# Altium schematic sheet PROC091F_RST_GPIOs_I2C.SchDoc: BREAKAWAY_SECTION2
size 431 x 279 mm; Date: Not shown in title block; ApprovedBy: Not shown in title block; CheckedBy: Not shown in title block; Author: Not shown in title block; CompanyName: Not shown in title block; DrawnBy: Antony/Bala; Engineer: Not shown in title block; Organization: Not shown in title block; Address1: Not shown in title block; Address2: Not shown in title block; Address3: Not shown in title block; Address4: Not shown in title block; DocumentNumber: 8; Revision: Use project parameter SCH_Rev; SheetNumber: 8; SheetTotal: 12; PageSetup: Record=PageOptions|CenterHorizontal=True|CenterVertical=True|PrintScale=1.00|XCorrection=1.00|YCorrection=1.00|PrintKind=0|BorderSize=5000000|LeftOffset=0|BottomOffset=0|Orientation=2|PaperLength=1000|PaperWidth=1000|Scale=100|PaperSource=15|PrintQuality=600|MediaType=1|DitherType=10|PaperKind=Letter|PrintScaleMode=1; CurrentTime: Not shown in title block; CurrentDate: Not shown in title block; Time: Not shown in title block; DocumentFullPathAndName: Not shown in title block; DocumentName: Not shown in title block; ModifiedDate: Not shown in title block; ImagePath: Not shown in title block
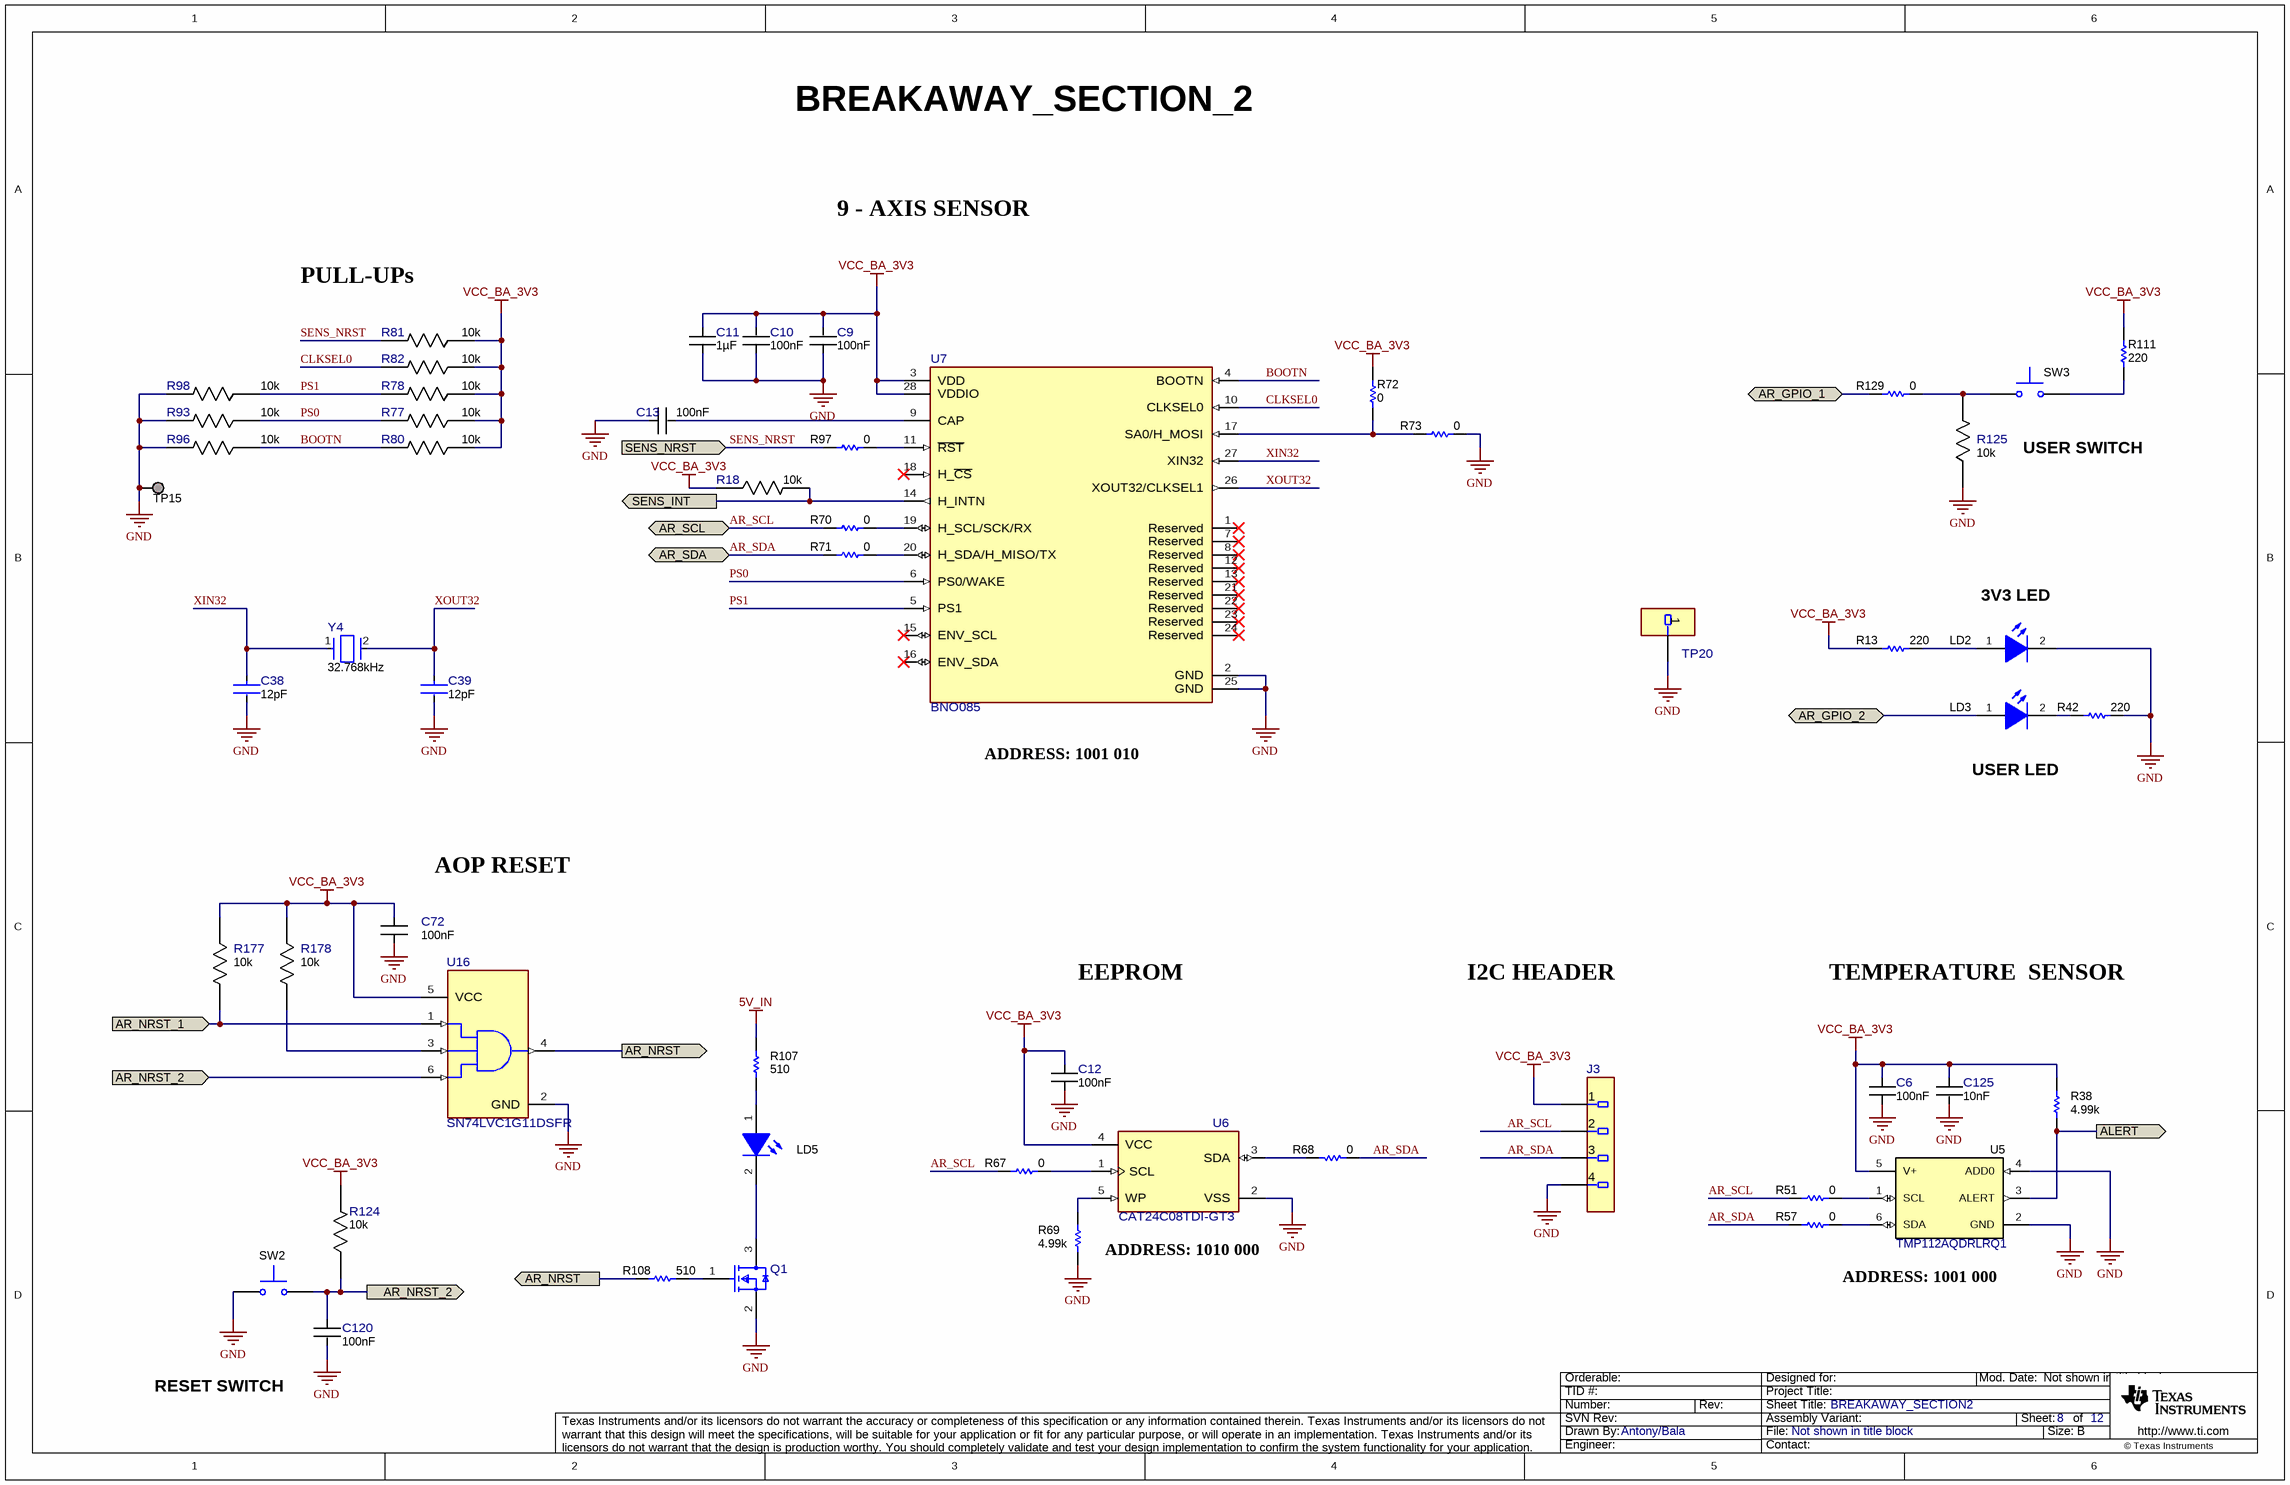
[diagram p0: PROC091F_RST_GPIOs_I2C.SchDoc]

## Parts
C6  Cap_F: 100nF  [FP-GRM033R6YA104KE14D_0201 (0603 Metric)-IPC_C]  (hidden comment: GRM033R6YA104KE14D)
C9  Cap_F: 100nF  [FP-GRM033R6YA104KE14D_0201 (0603 Metric)-IPC_C]  (hidden comment: GRM033R6YA104KE14D)
C10  Cap_F: 100nF  [FP-GRM033R6YA104KE14D_0201 (0603 Metric)-IPC_C]  (hidden comment: GRM033R6YA104KE14D)
C11  Cap_F: 1µF  [FP-CL03A105MO3NRNH_0201-IPC_C]  (hidden comment: CL03A105MO3NRNH)
C12  Cap_F: 100nF  [FP-GRM033R6YA104KE14D_0201 (0603 Metric)-IPC_C]  (hidden comment: GRM033R6YA104KE14D)
C13  Cap_F: 100nF  [FP-GRM033R6YA104KE14D_0201 (0603 Metric)-IPC_C]  (hidden comment: GRM033R6YA104KE14D)
C38  Cap_F: 12pF  [FP-250R05L120JV4T_0201-IPC_C]  (hidden comment: 250R05L120JV4T)
C39  Cap_F: 12pF  [FP-250R05L120JV4T_0201-IPC_C]  (hidden comment: 250R05L120JV4T)
C72  Cap_F: 100nF  [FP-GRM033R6YA104KE14D_0201 (0603 Metric)-IPC_C]  (hidden comment: GRM033R6YA104KE14D)
C120  Cap_F: 100nF  [FP-GRM033R6YA104KE14D_0201 (0603 Metric)-IPC_C]  (hidden comment: GRM033R6YA104KE14D)
C125  Cap_F: 10nF  [FP-CL03A103KA3NNNC_0201-IPC_C]  (hidden comment: CL03A103KA3NNNC)
J3  M50-3930442  [FP-M50-3930442_HDR4-Recommended_Land_Pattern]  (value not drawn)
LD2  APHHS1005CGCK  [APHHS1005_Green]  (value not drawn)
LD3  APHHS1005CGCK  [APHHS1005_Green]  (value not drawn)
LD5  APHHS1005CGCK  [APHHS1005_Green]  (value not drawn)
Q1  BSS123-7-F  [FP-BSS123-7-F_SOT23-IPC_C]  (value not drawn)
R13  value 220  [0201L]  (hidden comment: RC0201JR-07220RL)
R18  Res_ohm: 10k  [FP-RR0306P-103-D_0201-IPC_C]  (hidden comment: RR0306P-103-D)
R38  value 4.99k  [0201L]  (hidden comment: RC0201FR-074K99L)
R42  value 220  [0201L]  (hidden comment: RC0201JR-07220RL)
R51  Res_ohm: 0  [FP-RC0201JR-070RL_0201 (0603 Metric)-MFG]  (hidden comment: RC0201JR-070RL)
R57  Res_ohm: 0  [FP-RC0201JR-070RL_0201 (0603 Metric)-MFG]  (hidden comment: RC0201JR-070RL)
R67  Res_ohm: 0  [FP-RC0201JR-070RL_0201 (0603 Metric)-MFG]  (hidden comment: RC0201JR-070RL)
R68  Res_ohm: 0  [FP-RC0201JR-070RL_0201 (0603 Metric)-MFG]  (hidden comment: RC0201JR-070RL)
R69  value 4.99k  [0201L]  (hidden comment: RC0201FR-074K99L)
R70  Res_ohm: 0  [FP-RC0201JR-070RL_0201 (0603 Metric)-MFG]  (hidden comment: RC0201JR-070RL)
R71  Res_ohm: 0  [FP-RC0201JR-070RL_0201 (0603 Metric)-MFG]  (hidden comment: RC0201JR-070RL)
R72  Res_ohm: 0  [FP-RC0201JR-070RL_0201 (0603 Metric)-IPC_C]  (hidden comment: RC0201JR-070RL)
R73  Res_ohm: 0  [FP-RC0201JR-070RL_0201 (0603 Metric)-IPC_C]  (hidden comment: RC0201JR-070RL)
R77  Res_ohm: 10k  [FP-RR0306P-103-D_0201-IPC_C]  (hidden comment: RR0306P-103-D)
R78  Res_ohm: 10k  [FP-RR0306P-103-D_0201-IPC_C]  (hidden comment: RR0306P-103-D)
R80  Res_ohm: 10k  [FP-RR0306P-103-D_0201-IPC_C]  (hidden comment: RR0306P-103-D)
R81  Res_ohm: 10k  [FP-RR0306P-103-D_0201-IPC_C]  (hidden comment: RR0306P-103-D)
R82  Res_ohm: 10k  [FP-RR0306P-103-D_0201-IPC_C]  (hidden comment: RR0306P-103-D)
R93  Res_ohm: 10k  [FP-RR0306P-103-D_0201-IPC_C]  (hidden comment: RR0306P-103-D)
R96  Res_ohm: 10k  [FP-RR0306P-103-D_0201-IPC_C]  (hidden comment: RR0306P-103-D)
R97  Res_ohm: 0  [FP-RC0201JR-070RL_0201 (0603 Metric)-IPC_C]  (hidden comment: RC0201JR-070RL)
R98  Res_ohm: 10k  [FP-RR0306P-103-D_0201-IPC_C]  (hidden comment: RR0306P-103-D)
R107  value 510  [0201L]  (hidden comment: RC0201JR-07510RL)
R108  value 510  [0201L]  (hidden comment: RC0201JR-07510RL)
R111  value 220  [0201L]  (hidden comment: RC0201JR-07220RL)
R124  Res_ohm: 10k  [FP-RR0306P-103-D_0201-IPC_C]  (hidden comment: RR0306P-103-D)
R125  Res_ohm: 10k  [FP-RR0306P-103-D_0201-IPC_C]  (hidden comment: RR0306P-103-D)
R129  Res_ohm: 0  [FP-RC0201JR-070RL_0201 (0603 Metric)-IPC_C]  (hidden comment: RC0201JR-070RL)
R177  Res_ohm: 10k  [FP-RR0306P-103-D_0201-IPC_C]  (hidden comment: RR0306P-103-D)
R178  Res_ohm: 10k  [FP-RR0306P-103-D_0201-IPC_C]  (hidden comment: RR0306P-103-D)
SW2  B3U-1000P  [SW_B3U-1000P]  (value not drawn)
SW3  B3U-1000P  [SW_B3U-1000P]  (value not drawn)
TP15  TESTPOINT  [TP_25MIL-SMT]  (value not drawn)  (no BOM)
TP20  4953  [FP-4953_HDR1-MFG]  (value not drawn)
U5  TMP112AQDRLRQ1  [DRL0006A]
U6  CAT24C08TDI-GT3  [FP-CAT24C08TDI-GT3_TSOT-23-5-IPC_A]
U7  BNO085  [FP-BNO085_LGA28-MFG]
U16  SN74LVC1G11DSFR  [DSF0006A-MFG]
Y4  Frequency_Fixed: 32.768kHz  [FP-ABS05W-32.768KHZ-D-2-T_XTAL_SMT_1MM6_1MM0-MFG]  (hidden comment: ABS05W-32.768KHZ-D-2-T)

## Ports
ALERT (out), AR_GPIO_1 (bidir), AR_GPIO_2 (bidir), AR_NRST (out), AR_NRST_1 (in), AR_NRST_2 (in), AR_NRST_2 (out), AR_SCL (bidir), AR_SDA (bidir), SENS_INT (out), SENS_NRST (in)

## Nets
5V_IN: R107.1
GND: C6.1 C9.1 C10.1 C11.2 C12.1 C13.1 C38.2 C39.2 C72.1 C120.2 C125.2 J3.4 LD2.2(K) Q1.2(S) R42.2 R69.1 R73.1 R93.2 R96.2 R98.2 R125.1 SW2.2 TP15.1 TP20.1 U5.2(GND) U5.4(ADD0) U6.2(VSS) U7.2(GND) U7.25(GND) U16.2(GND)
VCC_BA_3V3: C6.2 C9.2 C10.2 C11.1 C12.2 C72.2 C125.1 J3.1 R13.1 R18.1 R38.2 R72.1 R77.1 R78.1 R80.1 R81.1 R82.1 R111.2 R124.2 R177.1 R178.1 U5.5(V+) U6.4(VCC) U7.3(VDD) U7.28(VDDIO) U16.5(VCC)
ALERT: R38.1 U5.3(ALERT) ; port ALERT
AR_GPIO_1: R129.2 ; port AR_GPIO_1
AR_GPIO_2: LD3.1(A) ; port AR_GPIO_2
AR_NRST: R108.1 U16.4(Y) ; port AR_NRST
AR_NRST_1: R177.2 U16.1(A) ; port AR_NRST_1
AR_NRST_2: C120.1 R124.1 SW2.1 U16.6(C) ; port AR_NRST_2
AR_SCL: J3.2 R51.1 R67.1 R70.2 ; port AR_SCL
AR_SDA: J3.3 R57.1 R68.1 R71.2 ; port AR_SDA
BOOTN: R80.2 R96.1 U7.4(BOOTN)
CLKSEL0: R82.2 U7.10(CLKSEL0)
PS0: R77.2 R93.1 U7.6(PS0/WAKE)
PS1: R78.2 R98.1 U7.5(PS1)
SENS_INT: R18.2 U7.14(H_INTN) ; port SENS_INT
SENS_NRST: R81.2 R97.2 ; port SENS_NRST
XIN32: C38.1 U7.27(XIN32) Y4.1
XOUT32: C39.1 U7.26(XOUT32/CLKSEL1) Y4.2
NetC13_2: C13.2 U7.9(CAP)
NetLD2_1: LD2.1(A) R13.2
NetLD3_2: LD3.2(K) R42.1
NetLD5_1: LD5.1(A) R107.2
NetLD5_2: LD5.2(K) Q1.3(D)
NetQ1_1: Q1.1(G) R108.2
NetR51_2: R51.2 U5.1(SCL)
NetR57_2: R57.2 U5.6(SDA)
NetR67_2: R67.2 U6.1(SCL)
NetR68_2: R68.2 U6.3(SDA)
NetR69_2: R69.2 U6.5(WP)
NetR70_1: R70.1 U7.19(H_SCL/SCK/RX)
NetR71_1: R71.1 U7.20(H_SDA/H_MISO/TX)
NetR72_2: R72.2 R73.2 U7.17(SA0/H_MOSI)
NetR97_1: R97.1 U7.11(~{RST})
NetR111_1: R111.1 SW3.2
NetR125_2: R125.2 R129.1 SW3.1
NetR178_2: R178.2 U16.3(B)

Not connected (* = marked no-connect by the designer): U7 1(Reserved)* 7(Reserved)* 8(Reserved)* 12(Reserved)* 13(Reserved)* 15(ENV_SCL)* 16(ENV_SDA)* 18(H_~{CS})* 21(Reserved)* 22(Reserved)* 23(Reserved)* 24(Reserved)*

## Notes on the sheet
- BREAKAWAY_SECTION_2
- 9 - AXIS SENSOR
- PULL-UPs
- (near SW3) USER SWITCH
- (near LD2) 3V3 LED
- ADDRESS: 1001 010
- USER LED
- AOP RESET
- EEPROM
- I2C HEADER
- TEMPERATURE  SENSOR
- ADDRESS: 1010 000
- ADDRESS: 1001 000
- RESET SWITCH
- Drawn By:
- SVN Rev:
- Number:
- TID #:
- Orderable:
- Rev:
- Sheet Title:
- File:
- Project Title:
- Designed for:
- Assembly Variant:
- Mod. Date:
- Sheet:
- Size:
- of
- B
- http://www.ti.com
- Texas Instruments and/or its licensors do not warrant the accuracy or completeness of this specification or any information contained therein. Texas Instruments and/or its licensors do not warrant that this design will meet the specifications, will be suitable for your application or fit for any particular purpose, or will operate in an implementation. Texas Instruments and/or its licensors do not warrant that the design is production worthy. You should completely validate and test your design implementation to confirm the system functionality for your application.
- Engineer:
- Contact:
- © Texas Instruments

## Library data of the parts
C6 C9 C10 C12 C13 C72 C120 = CMP-0086440-1: Cap Ceramic 0.1uF 35V X5R 10% Pad SMD 0201 85C T/R; Manufacturer: Murata Electronics North America; AEC Qualified: No; SizeZ_mm: 0.33mm; Symbol Name: SYM-GRM033R6YA104KE14D; TempCo: 15%; RoHS: TRUE; ComponentLink1Description: Datasheet; ComponentLink1URL: https://search.murata.co.jp/Ceramy/image/img/A01X/G101/ENG/GRM033R6YA104KE14-01.pdf; PackageReference: 0201 (0603 Metric); PartNumber: GRM033R6YA104KE14D; Tolerance_%: 10%; VDC_V: 35V
C11 = CMP-0086446-1: 1µF ±20% 16V Ceramic Capacitor X5R 0201; Manufacturer: Samsung Electro-Mechanics; AEC Qualified: No; SizeZ_mm: 0.39mm; Symbol Name: SYM-CL03A105MO3NRNH; TempCo: 15%; RoHS: TRUE; ComponentLink1Description: Datasheet; ComponentLink1URL: http://www.samsungsem.com/global/front/downloadcms.do?path=%2F%2Fglobal%2F%2Fsupport%2F%2Fproduct-search%2F%2Fmlcc%2F%2F__icsFiles%2F%2Fafieldfile%2F%2F2018%2F%2F06%2F%2F21&fileName=CL03A105MO3NRNH.pdf; PackageReference: 0201; PartNumber: CL03A105MO3NRNH; Tolerance_%: 20%; VDC_V: 16V
C38 C39 = CMP-0087190-1: CAP CER 12PF 25V C0G/NP0 0201; Manufacturer: Johanson Technology Inc.; AEC Grade: Grade 1; AEC Qualified: Yes; SizeZ_mm: 0.33mm; Symbol Name: SYM-250R05L120JV4T; TempCo: 30ppm/°C; Tolerance_%: 5%; RoHS: TRUE; ComponentLink1Description: Datasheet; ComponentLink1URL: https://www.johansontechnology.com/downloads/catalog/johanson-technology-multi-layer-high-q-capacitors.pdf; PackageReference: 0201; PartNumber: 250R05L120JV4T; VDC_V: 25V
C125 = CMP-0086445-1: CAP CER 10000PF 25V X5R 0201; Manufacturer: Samsung Electro-Mechanics America, Inc; AEC Qualified: No; SizeZ_mm: 0.33mm; Symbol Name: SYM-CL03A103KA3NNNC; TempCo: 15%; Tolerance_%: 10%; RoHS: TRUE; ComponentLink1Description: Datasheet; ComponentLink1URL: http://www.samsungsem.com/global/front/downloadcms.do?path=%2F%2Fglobal%2F%2Fsupport%2F%2Fproduct-search%2F%2Fmlcc%2F%2F__icsFiles%2F%2Fafieldfile%2F%2F2018%2F%2F06%2F%2F19&fileName=CL03A103KA3NNNC.pdf; PackageReference: 0201; PartNumber: CL03A103KA3NNNC; VDC_V: 25V
J3 = CMP-0087187-1: CONN HDR 1.27MM R/A AU 4POS; Manufacturer: Harwin Inc.; ContactFinish: Gold; Current_A: 1A; Row_Count: 1; RoHS: TRUE; ComponentLink1Description: Datasheet; ComponentLink1URL: https://cdn.harwin.com/pdfs/M50-393.pdf; PackageReference: HDR4; PartNumber: M50-3930442; PinCount: 4; Symbol Name: SYM-M50-3930442
LD2 LD3 LD5 = CMP-0067682-2: LED, Green, SMD; Manufacturer: Kingbright; Angle: 120.0; Power_TotalModule: 75mW; SizeZ_mm: 0.6; Vf_V: 2.1V; Vr_V: 5V; Io_A: 20mA; Ir_A: 10µA; SizeArea_mm2: 0.5; SizeAreaWB_mm2: 3.0; SizeX_mm: 1.0; Tjmax_C: 85°C; Value1: 0.075W; RoHS: Y; Color: Green; ComponentLink1Description: Datasheet link; ComponentLink1URL: http://www.kingbrightusa.com/images/catalog/SPEC/APHHS1005CGCK.pdf; PackageReference: 0402; PartNumber: APHHS1005CGCK; CompType: LED; MountType: SMT; SizeY_mm: 0.5; Type: ?; Value2: 2.1V; Value: Green
Q1 = CMP-0087176-1: MOSFET N-CH 100V 170MA SOT23-3; Manufacturer: Diodes Incorporated; AEC Qualified: No; ChMode: False; Rdson45_ohm: 6; SizeZ_mm: 1.1mm; Vgs_V: 20V; RoHS: TRUE; ComponentLink1Description: Datasheet; ComponentLink1URL: https://www.diodes.com/assets/Datasheets/ds30366.pdf; IdsMax_A: 170mA; PackageReference: SOT23; PartNumber: BSS123-7-F; Symbol Name: SYM-BSS123-7-F; VdsMax_V: 100V
R13 R42 R111 = CMP-0027072-1: RES, 220, 5%, 0.05 W, 0201; Manufacturer: Yageo America; AEC Category: Q200; AEC Qualified: N; EIA_Code: E24; Power_W: 50mW; SizeArea_mm2: 0.18; SizeX_mm: 0.6; SizeY_mm: 0.3; SizeZ_mm: 0.26; TempCo: 200 ppm/C; U/M: EA; Value2: 0.05W; Value_Code: 220R; VDC_V: 25V; RoHS: Y; AEC Grade: N/A; ComponentLink1Description: Datasheet link; ComponentLink1URL: http://www.yageo.com/documents/recent/PYu-RC_Group_51_RoHS_L_5.pdf; CompType: Resistor; LatestRevisionDate: 2017-03-09; MountType: SMT; PackageReference: 0201; PartNumber: RC0201JR-07220RL; Published: 2016-10-14; Publisher: Texas Instruments; Res_ohm: 220; Supplier 1: Digi-Key; Supplier 2: Mouser; Supplier Part Number 1: 311-220NCT-ND; Supplier Part Number 2: 603-RC0201JR-07220RL; Technology: Thick Film; Tolerance_%: 5%; Value1: 5%; ValueDisplayed: 220
R18 R77 R78 R80-R82 R93 R96 R98 R124 R125 R177 R178 = CMP-0088002-1: 10 kOhms ±0.5% 0.05W, 1/20W Chip Resistor 0201 (0603 Metric)  Thin Film; Manufacturer: Susumu; AEC Qualified: No; Power_W: 50mW; SizeZ_mm: 0.26mm; Symbol Name: SYM-RR0306P-103-D; TempCo: 25ppm/°C; VDC_V: 15V; RoHS: TRUE; ComponentLink1Description: Datasheet; ComponentLink1URL: https://www.susumu.co.jp/common/pdf/n_catalog_partition05_en.pdf; PackageReference: 0201; PartNumber: RR0306P-103-D; Technology: Thin Film; Tolerance_%: 0.5%
R38 R69 = CMP-0027745-1: RES, 4.99 k, 1%, 0.05 W, 0201; Manufacturer: Yageo America; AEC Category: Q200; AEC Qualified: N; EIA_Code: E96; Power_W: 50mW; SizeArea_mm2: 0.18; SizeX_mm: 0.6; SizeY_mm: 0.3; SizeZ_mm: 0.26; TempCo: 200 ppm/C; U/M: EA; Value2: 0.05W; Value_Code: 4k99; VDC_V: 25V; RoHS: Y; AEC Grade: N/A; ComponentLink1Description: Datasheet link; ComponentLink1URL: http://www.yageo.com/documents/recent/PYu-RC_Group_51_RoHS_L_5.pdf; CompType: Resistor; LatestRevisionDate: 2017-03-09; MountType: SMT; PackageReference: 0201; PartNumber: RC0201FR-074K99L; Published: 2016-10-14; Publisher: Texas Instruments; Res_ohm: 4.99k; Supplier 1: Digi-Key; Supplier 2: Mouser; Supplier Part Number 1: YAG2712CT-ND; Supplier Part Number 2: 603-RC0201FR-074K99L; Technology: Thick Film; Tolerance_%: 1%; Value1: 1%; ValueDisplayed: 4.99k
R51 R57 R67 R68 R70-R73 R97 R129 = CMP-0086442-2: RES SMD 0 OHM JUMPER 1/20W 0201; Manufacturer: Yageo; AEC Qualified: No; Power_W: 50mW; SizeZ_mm: 0.26mm; TempCo: 200ppm/°C; Tolerance_%: 5%; VDC_V: 25V; RoHS: TRUE; ComponentLink1Description: Datasheet; ComponentLink1URL: http://www.yageo.com/documents/recent/PYu-RC_Group_51_RoHS_L_10.pdf; PackageReference: 0201 (0603 Metric); PartNumber: RC0201JR-070RL; Technology: Thick Film
R107 R108 = CMP-0027137-1: RES, 510, 5%, 0.05 W, 0201; Manufacturer: Yageo America; AEC Category: Q200; AEC Qualified: N; EIA_Code: E24; Power_W: 50mW; SizeArea_mm2: 0.18; SizeX_mm: 0.6; SizeY_mm: 0.3; SizeZ_mm: 0.26; TempCo: 200 ppm/C; U/M: EA; Value2: 0.05W; Value_Code: 510R; VDC_V: 25V; RoHS: Y; AEC Grade: N/A; ComponentLink1Description: Datasheet link; ComponentLink1URL: http://www.yageo.com/documents/recent/PYu-RC_Group_51_RoHS_L_5.pdf; CompType: Resistor; LatestRevisionDate: 2017-03-09; MountType: SMT; PackageReference: 0201; PartNumber: RC0201JR-07510RL; Published: 2016-10-14; Publisher: Texas Instruments; Res_ohm: 510; Supplier 1: Digi-Key; Supplier 2: Mouser; Supplier Part Number 1: YAG2907CT-ND; Supplier Part Number 2: 603-RC0201JR-07510RL; Technology: Thick Film; Tolerance_%: 5%; Value1: 5%; ValueDisplayed: 510
SW2 SW3 = CMP-0002150-2: SWITCH TACTILE SPST-NO 0.05A 12V; Manufacturer: Omron Electronic Components; CurrentRating_mA: 50A; PositionCount: 1; SwitchFunction: Off-Mom; RoHS: Y; Circuit: SPST-NO; ComponentLink1Description: Datasheet URL; ComponentLink1URL: http://www.components.omron.com/components/web/PDFLIB.nsf/0/2DD3893C7DD33E9E862572900079E9D6/$file/B3U_1110.pdf; CompType: Switch; LatestRevisionDate: 2017-03-09; MountType: SMT; Orientation: Top Actuated; PackageReference: 3x1.6x2.5mm; PartNumber: B3U-1000P; Publisher: Texas Instruments; Supplier 1: Digi-Key; Supplier 2: Newark; Supplier 3: Mouser; Supplier Part Number 1: SW1020CT-ND; Supplier Part Number 2: 34M5295; Supplier Part Number 3: 653-B3U-1000P; VDC_V: 12V
TP15 = CMP-0078143-3: TEST POINT.  No entry in BOM.; CompType: Testpoint; Manufacturer: N/A; PackageReference: N/A; PartNumber: N/A; Library Reference: TESTPOINT
TP20 = CMP-0086474-1: PC Test Point, Loop Brass, Tin Plating 0.047" (1.19mm) Hole Diameter Mounting Type; Manufacturer: Keystone Electronics; RoHS: TRUE; ComponentLink1Description: Datasheet; ComponentLink1URL: https://www.keyelco.com/product-pdf.cfm?p=1307; ContactFinish: Tin; PackageReference: HDR1; PartNumber: 4953; PinCount: 1; Symbol Name: SYM-4953
U5 = CMP-0067398-2: Automotive Grade, 1.4V-Capable +/-0.5degC Temperature Sensor with Alert Function and I2C/SMBus, DRL0006A (SOT-OTHER-6); Alternate Manufacturer: Texas Instruments; CompType: IC; SizeArea_mm2: 2.56; SizeAreaWB_mm2: 6.76; SizeX_mm: 1.6; SizeZ_mm: 0.6; U/M: EA; RoHS: Y; ComponentLink1Description: Datasheet Link; ComponentLink1URL: http://www.ti.com/lit/ds/symlink/tmp112-q1.pdf; LatestRevisionDate: 2017-06-09; Manufacturer: Texas Instruments; MountType: SMT; PackageDescription: SOT-OTHER-6; PackageReference: DRL0006A; PartNumber: TMP112AQDRLRQ1; Publisher: Texas Instruments; SizeY_mm: 1.6
U6 = CMP-0087170-1: 8KB I2C SER EEPROM TSOT 23; Manufacturer: ON Semiconductor; SizeZ_mm: 1mm; RoHS: TRUE; ComponentLink1Description: Datasheet; ComponentLink1URL: https://www.onsemi.com/pub/Collateral/CAT24C01-D.PDF; PackageReference: TSOT-23-5; PartNumber: CAT24C08TDI-GT3; Symbol Name: SYM-CAT24C08TDI-GT3
U7 = CMP-0087171-1: IMU ACCEL/GYRO/MAG I2C 32BIT; Manufacturer: Hillcrest Laboratories, Inc.; SizeZ_mm: 1.18mm; RoHS: TRUE; ComponentLink1Description: Datasheet; ComponentLink1URL: https://www.hillcrestlabs.com/download/5a747b8d566d073a5d000536; PackageReference: LGA28; PartNumber: BNO085; Symbol Name: SYM-BNO085
U16 = CMP-0087998-2: AND Gate IC 1 Channel  6-SON (1x1); Manufacturer: Texas Instruments; TJmax_C: +150°C; PositionCount: 1; Number Of Inputs: 3; SizeZ_mm: 0.4mm; TaMax_C: +125°C; Max Supply Voltage: 5.5V; Min Supply Voltage: 1.65V; Standoff Height: 0mm; AEC Qualified: No; TaMin_C: -40°C; AEC Category: Q200; Datasheet Path: datasheets/IC_SN74LVC1G11DSFR.pdf; Lead Free: Yes; PackageReference: X2SON-6; helpURL: https://upverter.com/upn/revision/721ddc34b28c671c/; datasheet: http://www.ti.com/lit/ds/symlink/sn74lvc1g11.pdf; Mouser Part Number: 595-SN74LVC1G11DSFR; Digikey Part Number: 296-30121-1-ND; Logic Function Desc: AND; ComponentLink1URL: http://www.ti.com/lit/ds/symlink/sn74lvc1g11.pdf; Part Number: SN74LVC1G11DSFR; RoHS: TRUE; Number Of Outputs: 1; ComponentLink1Description: Datasheet; Mouser Description: Logic Gates Sgl 3-Inp Pos-AND Gate; Operating Temperature Range: -40°C to +125°C; Digikey Description: IC GATE AND 1CH 3-INP 6SON; ComponentLink2Description: Product Folder; ComponentLink2URL: http://www.ti.com/product/GPN; ComponentLink3Description: Online Datasheet; ComponentLink3URL: http://www.ti.com/product/GPN/datasheet; CompType: IC; PartNumber: SN74LVC1G11DSFR
Y4 = CMP-0088006-1: CRYSTAL 32.768KHZ 4PF SMD; Manufacturer: Abracon LLC; AEC Qualified: No; Frequency Tolerance: 20ppm; SizeZ_mm: 0.5mm; RoHS: TRUE; ComponentLink1Description: Datasheet; ComponentLink1URL: https://abracon.com/Resonators/ABS05W.pdf; Load Capacitance: 4pF; PackageReference: XTAL_SMT_1MM6_1MM0; PartNumber: ABS05W-32.768KHZ-D-2-T; Symbol Name: SYM-ABS05W-32.768KHZ-D-2-T